# EAGLE schematic untitled (EAGLE 6.4)

## Sheet 1 of 3
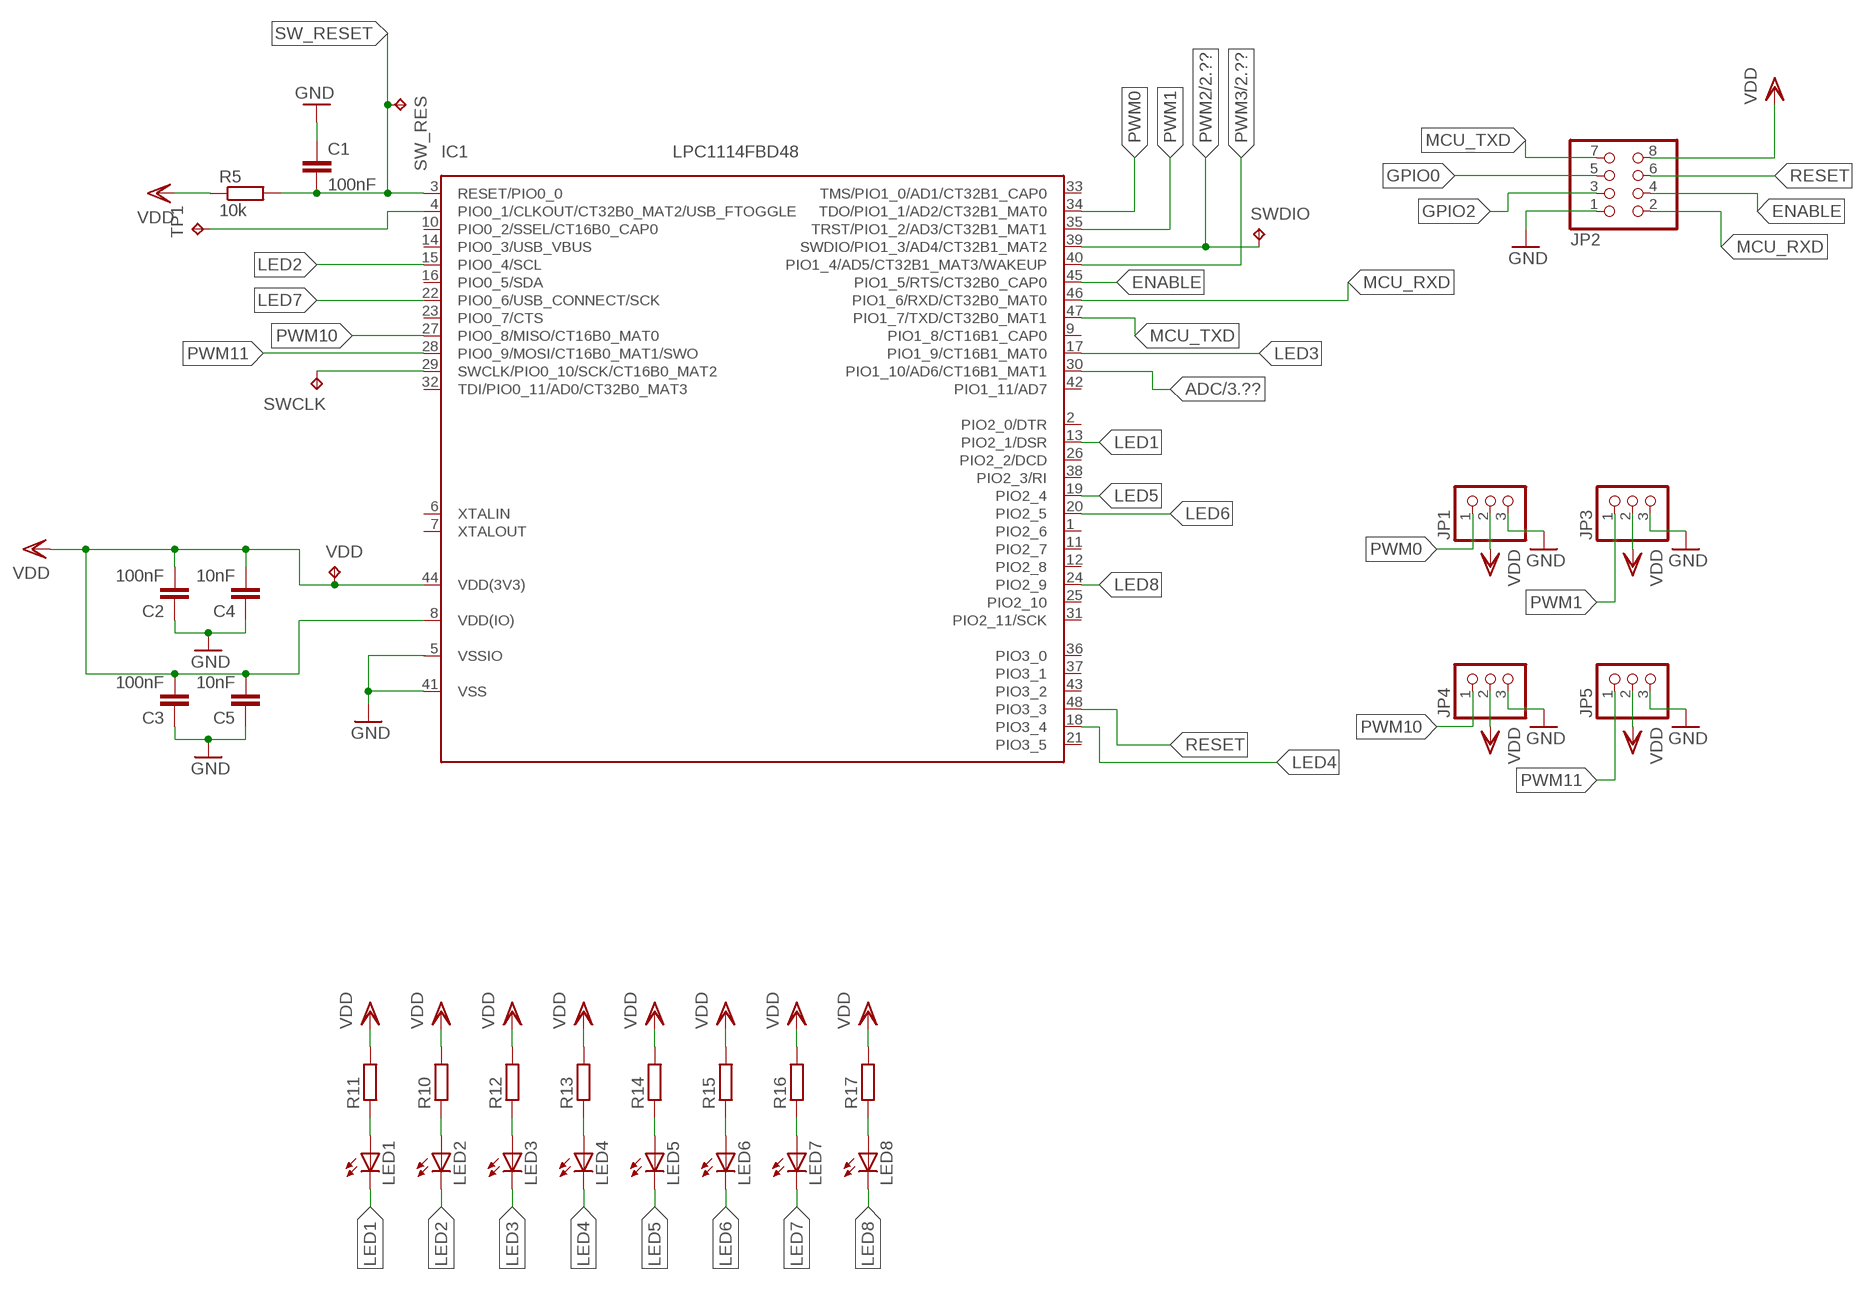
[diagram p0: schematic, sheet 1]

### Parts
C1  100nF  C-EUC0805  [C0805]
C2  100nF  C-EUC0805  [C0805]
C3  100nF  C-EUC0805  [C0805]
C4  10nF  C-EUC0805  [C0805]
C5  10nF  C-EUC0805  [C0805]
IC1  LPC1114FBD48  [LQFP48-7X7]
JP1  PINHD-1X3  [1X03]
JP2  PINHD-2X4  [2X04]
JP3  PINHD-1X3  [1X03]
JP4  PINHD-1X3  [1X03]
JP5  PINHD-1X3  [1X03]
LED1  LEDCHIP-LED0805  [CHIP-LED0805]
LED2  LEDCHIP-LED0805  [CHIP-LED0805]
LED3  LEDCHIP-LED0805  [CHIP-LED0805]
LED4  LEDCHIP-LED0805  [CHIP-LED0805]
LED5  LEDCHIP-LED0805  [CHIP-LED0805]
LED6  LEDCHIP-LED0805  [CHIP-LED0805]
LED7  LEDCHIP-LED0805  [CHIP-LED0805]
LED8  LEDCHIP-LED0805  [CHIP-LED0805]
R5  10k  R-EU_R0805  [R0805]
R10  R-EU_R0805  [R0805]
R11  R-EU_R0805  [R0805]
R12  R-EU_R0805  [R0805]
R13  R-EU_R0805  [R0805]
R14  R-EU_R0805  [R0805]
R15  R-EU_R0805  [R0805]
R16  R-EU_R0805  [R0805]
R17  R-EU_R0805  [R0805]
SW_RES  TPB1,27  [B1,27]
SWCLK  TPB1,27  [B1,27]
SWDIO  TPB1,27  [B1,27]
TP1  TPB1,27  [B1,27]
VDD  TPB1,27  [B1,27]

### Nets
ADC: IC1.30(PIO1_10/AD6/CT16B1_MAT1) ; also sheet 3
ENABLE: IC1.45(PIO1_5/RTS/CT32B0_CAP0) JP2.4
GND: C1.1 C2.1 C3.1 C4.1 C5.1 IC1.41(VSS) JP1.3 JP2.1 JP3.3 JP4.3 JP5.3 ; also sheet 2,3
GPIO0: JP2.5
GPIO2: JP2.3
LED1: IC1.13(PIO2_1/DSR) LED1.C
LED2: IC1.15(PIO0_4/SCL) LED2.C
LED3: IC1.17(PIO1_9/CT16B1_MAT0) LED3.C
LED4: IC1.18(PIO3_4) LED4.C
LED5: IC1.19(PIO2_4) LED5.C
LED6: IC1.20(PIO2_5) LED6.C
LED7: IC1.22(PIO0_6/USB_CONNECT/SCK) LED7.C
LED8: IC1.24(PIO2_9) LED8.C
MCU_RXD: IC1.46(PIO1_6/RXD/CT32B0_MAT0) JP2.2
MCU_TXD: IC1.47(PIO1_7/TXD/CT32B0_MAT1) JP2.7
N$10: LED1.A R11.1
N$11: LED2.A R10.1
N$12: LED3.A R12.1
N$13: LED4.A R13.1
N$14: LED5.A R14.1
N$15: LED6.A R15.1
N$16: LED7.A R16.1
N$17: LED8.A R17.1
N$18: IC1.4(PIO0_1/CLKOUT/CT32B0_MAT2/USB_FTOGGLE) TP1.TP
PWM0: IC1.34(TDO/PIO1_1/AD2/CT32B1_MAT0) JP1.1
PWM1: IC1.35(TRST/PIO1_2/AD3/CT32B1_MAT1) JP3.1
PWM2: IC1.39(SWDIO/PIO1_3/AD4/CT32B1_MAT2) SWDIO.TP ; also sheet 2
PWM3: IC1.40(PIO1_4/AD5/CT32B1_MAT3/WAKEUP) ; also sheet 2
PWM10: IC1.27(PIO0_8/MISO/CT16B0_MAT0) JP4.1
PWM11: IC1.28(PIO0_9/MOSI/CT16B0_MAT1/SWO) JP5.1
PWM12: IC1.29(SWCLK/PIO0_10/SCK/CT16B0_MAT2) SWCLK.TP
RESET: IC1.48(PIO3_3) JP2.6
SW_RESET: C1.2 IC1.3(RESET/PIO0_0) R5.2 SW_RES.TP
VDD: C2.2 C3.2 C4.2 C5.2 IC1.8(VDD(IO)) IC1.44(VDD(3V3)) JP1.2 JP2.8 JP3.2 JP4.2 JP5.2 R5.1 R10.2 R11.2 R12.2 R13.2 R14.2 R15.2 R16.2 R17.2 VDD.TP ; also sheet 3
Unconnected: IC1.1(PIO2_6) IC1.2(PIO2_0/DTR) IC1.6(XTALIN) IC1.7(XTALOUT) IC1.9(PIO1_8/CT16B1_CAP0) IC1.10(PIO0_2/SSEL/CT16B0_CAP0) IC1.11(PIO2_7) IC1.12(PIO2_8) IC1.14(PIO0_3/USB_VBUS) IC1.16(PIO0_5/SDA) IC1.21(PIO3_5) IC1.23(PIO0_7/CTS) IC1.25(PIO2_10) IC1.26(PIO2_2/DCD) IC1.31(PIO2_11/SCK) IC1.32(TDI/PIO0_11/AD0/CT32B0_MAT3) IC1.33(TMS/PIO1_0/AD1/CT32B1_CAP0) IC1.36(PIO3_0) IC1.37(PIO3_1) IC1.38(PIO2_3/RI) IC1.42(PIO1_11/AD7) IC1.43(PIO3_2)

## Sheet 2 of 3
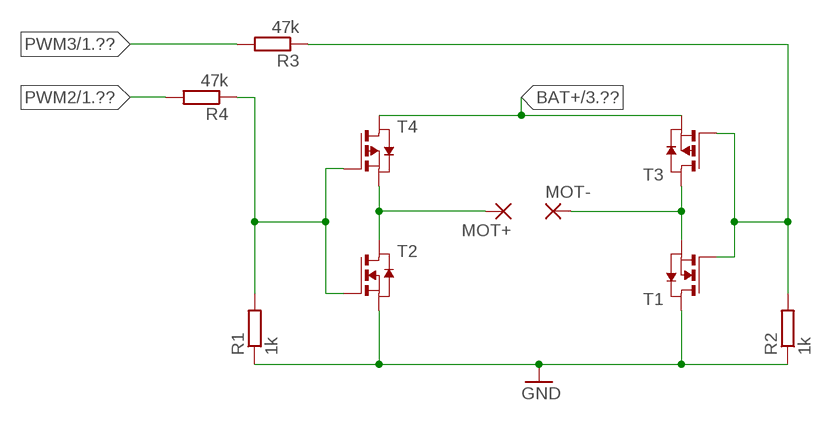
[diagram p1: schematic, sheet 2]

### Parts
MOT+  SMD5  [SMD2,54-5,08]
MOT-  SMD5  [SMD2,54-5,08]
R1  1k  R-EU_R0805  [R0805]
R2  1k  R-EU_R0805  [R0805]
R3  47k  R-EU_R0805  [R0805]
R4  47k  R-EU_R0805  [R0805]
T1  NMOSSOT23  [SOT-23]
T2  NMOSSOT23  [SOT-23]
T3  PMOSSOT23  [SOT-23]
T4  PMOSSOT23  [SOT-23]

### Nets
BAT+: T3.2(S) T4.1(D) ; also sheet 3
GND: R1.1 R2.1 T1.1(D) T2.2(S) ; also sheet 1,3
N$1: R2.2 R3.1 T1.3(G) T3.3(G)
N$3: MOT+.1(P) T2.1(D) T4.2(S)
N$4: MOT-.1(P) T1.2(S) T3.1(D)
N$5: R1.2 R4.1 T2.3(G) T4.3(G)
PWM2: R4.2 ; also sheet 1
PWM3: R3.2 ; also sheet 1

## Sheet 3 of 3
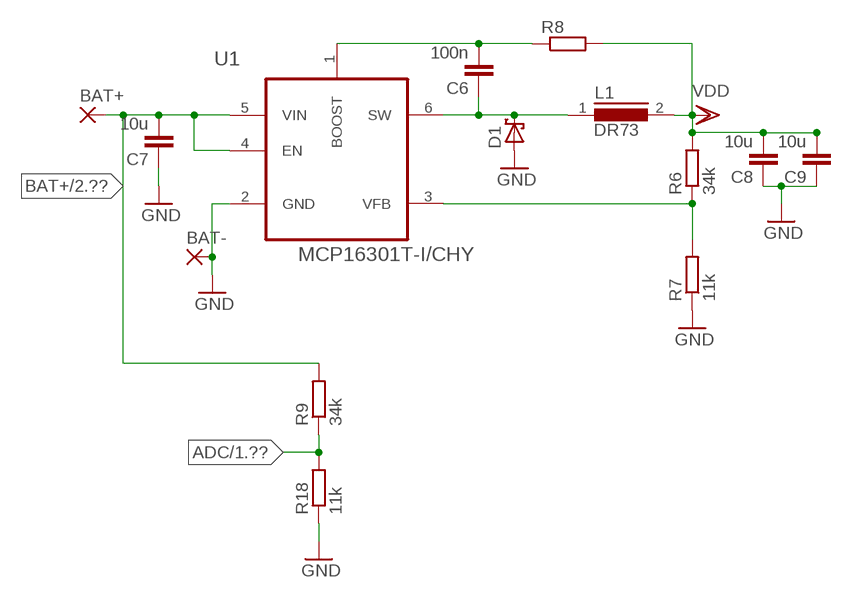
[diagram p2: schematic, sheet 3]

### Parts
BAT+  SMD5  [SMD2,54-5,08]
BAT-  SMD5  [SMD2,54-5,08]
C6  100n  C-EUC0805  [C0805]
C7  10u  C-EUC0805  [C0805]
C8  10u  C-EUC0805  [C0805]
C9  10u  C-EUC0805  [C0805]
D1  SCHOTTKY-DIODESMD  [SMB]
L1  DR73  [DR73]
R6  34k  R-EU_R0805  [R0805]
R7  11k  R-EU_R0805  [R0805]
R8  R-EU_R0603  [R0603]
R9  34k  R-EU_R0805  [R0805]
R18  11k  R-EU_R0805  [R0805]
U1  MCP16301T-I/CHY  [SOT95P290X145-6N]

### Nets
ADC: R9.1 R18.2 ; also sheet 1
BAT+: BAT+.1(P) C7.2 R9.2 U1.4(EN) U1.5(VIN) ; also sheet 2
GND: BAT-.1(P) C7.1 C8.1 C9.1 D1.A R7.1 R18.1 U1.2(GND) ; also sheet 1,2
N$2: R6.1 R7.2 U1.3(VFB)
N$6: C6.1 D1.C L1.1 U1.6(SW)
N$8: C6.2 R8.1 U1.1(BOOST)
VDD: C8.2 C9.2 L1.2 R6.2 R8.2 ; also sheet 1

## Power pins joined to a net without a drawn wire
VSSIO: IC1.5(VSSIO)

## Library data of the parts
BAT+ BAT- MOT+ MOT- = wirepad:SMD5: SMD PAD
C1-C9 = rcl:C-EU: CAPACITOR, European symbol
D1 = diode:SCHOTTKY-DIODE: Schottky Diode
IC1 = lpc1xxx-v6:LPC1114FBD48: LPC1114 50 MHz 32-bit ARM Cortex-M0 based microcontroller featuring a high level of integration and very low power consumption. 32 kB Flash, 8 or 4 kB SRAM MarcVl - Datasheet available on www.nxp.com
JP1 JP3-JP5 = pinhead:PINHD-1X3: PIN HEADER
JP2 = pinhead:PINHD-2X4: PIN HEADER
L1 = inductors:DR73: High Power Density, High Efficiency, Shielded Inductors Source: coiltronics_dr_series.pdf
LED1-LED8 = led:LED: LED OSRAM: - CHIPLED LG R971, LG N971, LY N971, LG Q971, LY Q971, LO R971, LY R971 LH N974, LH R974 LS Q976, LO Q976, LY Q976 LO Q996 - Hyper CHIPLED LW Q18S LB Q993, LB Q99A, LB R99A - SideLED LS A670, LO A670, LY A670, LG A670, LP A670 LB A673, LV A673, LT A673, LW A673 LH A674 LY A675 LS A676, LA A676, LO A676, LY A676, LW A676 LS A679, LY A679, LG A679 - Hyper Micro SIDELED® LS Y876, LA Y876, LO Y876, LY Y876 LT Y87S - SmartLED LW L88C, LW L88S LB L89C, LB L89S, LG L890 LS L89K, LO L89K, LY L89K LS L896, LA L896, LO L896, LY L896 - TOPLED LS T670, LO T670, LY T670, LG T670, LP T670 LSG T670, LSP T670, LSY T670, LOP T670, LYG T670 LG T671, LOG T671, LSG T671 LB T673, LV T673, LT T673, LW T673 LH T674 LS T676, LA T676, LO T676, LY T676, LB T676, LH T676, LSB T676, LW T676 LB T67C, LV T67C, LT T67C, LS T67K, LO T67K, LY T67K, LW E67C LS E67B, LA E67B, LO E67B, LY E67B, LB E67C, LV E67C, LT E67C LW T67C LS T679, LY T679, LG T679 LS T770, LO T770, LY T770, LG T770, LP T770 LB T773, LV T773, LT T773, LW T773 LH T774 LS E675, LA E675, LY E675, LS T675 LS T776, LA T776, LO T776, LY T776, LB T776 LHGB T686 LT T68C, LB T68C - Hyper Mini TOPLED® LB M676 - Mini TOPLED Santana® LG M470 LS M47K, LO M47K, LY M47K Source: http://www.osram.convergy.de LUXEON: - LUMILED® LXK2-PW12-R00, LXK2-PW12-S00, LXK2-PW14-U00, LXK2-PW14-V00 LXK2-PM12-R00, LXK2-PM12-S00, LXK2-PM14-U00 LXK2-PE12-Q00, LXK2-PE12-R00, LXK2-PE12-S00, LXK2-PE14-T00, LXK2-PE14-U00 LXK2-PB12-K00, LXK2-PB12-L00, LXK2-PB12-M00, LXK2-PB14-N00, LXK2-PB14-P00, LXK2-PB14-Q00 LXK2-PR12-L00, LXK2-PR12-M00, LXK2-PR14-Q00, LXK2-PR14-R00 LXK2-PD12-Q00, LXK2-PD12-R00, LXK2-PD12-S00 LXK2-PH12-R00, LXK2-PH12-S00 LXK2-PL12-P00, LXK2-PL12-Q00, LXK2-PL12-R00 Source: www.luxeon.com KINGBRIGHT: KA-3528ASYC Source: www.kingbright.com
R1-R18 = rcl:R-EU_: RESISTOR, European symbol
SW_RES SWCLK SWDIO TP1 VDD = testpad:TP: Test pad
T1 T2 = zetex:NMOSSOT23: MOS FET; OC_FARNELL: unknown; OC_NEWARK: unknown
T3 T4 = zetex:PMOSSOT23: MOS FET; OC_FARNELL: unknown; OC_NEWARK: unknown
U1 = mcp1630:MCP16301T-I/CHY: IC, BUCK, ADJ, 0.6A, 6SOT23; MPN: MCP16301T-I/CHY; OC_FARNELL: 2009288; OC_NEWARK: 58T3650; PACKAGE: SOT23-6; SUPPLIER: Microchip